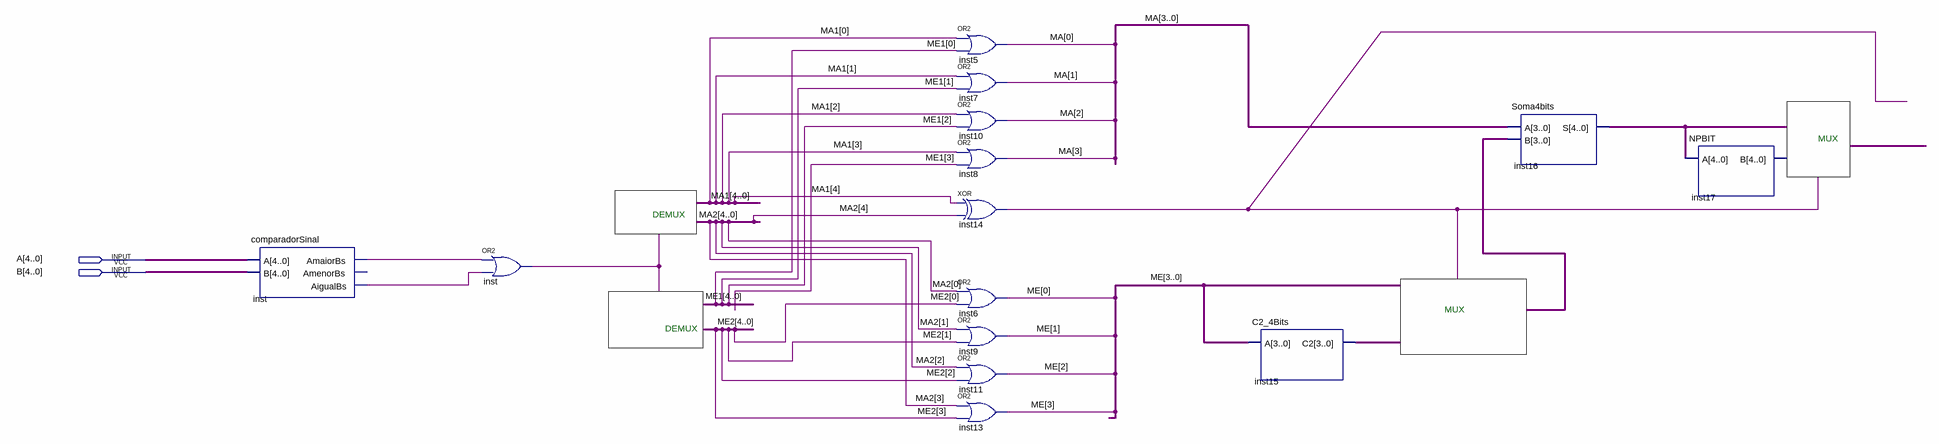
[diagram p0: schematic sheet]
// Quartus schematic Somador.bdf as structural Verilog: 14 symbols, 2 pins
module Somador (
  input  [4:0] A,
  input  [4:0] B
);

  wire inst14_out, inst_aigualbs, inst_amaiorbs, inst_out;
  wire [3:0] inst15_c2, MA, ME, ME1, ME2, undriven;
  wire [4:0] inst16_s, MA1, MA2;

  comparadorSinal inst (.A(A), .B(B), .AmaiorBs(inst_amaiorbs), .AigualBs(inst_aigualbs));  // open: AmenorBs
  or inst_dup2 (inst_out, inst_amaiorbs, inst_aigualbs);
  or inst5 (MA[0], MA1[0], ME1[0]);
  or inst7 (MA[1], MA1[1], ME1[1]);
  or inst10 (MA[2], MA1[2], ME1[2]);
  or inst8 (MA[3], MA1[3], ME1[3]);
  xor inst14 (inst14_out, MA1[4], MA2[4]);
  or inst6 (ME[0], MA2[0], ME2[0]);
  or inst9 (ME[1], MA2[1], ME2[1]);
  or inst11 (ME[2], MA2[2], ME2[2]);
  or inst13 (ME[3], MA2[3], ME2[3]);
  C2_4Bits inst15 (.A(ME), .C2(inst15_c2));
  Soma4bits inst16 (.A(MA), .B(undriven), .S(inst16_s));
  NPBIT inst17 (.A(inst16_s));  // open: B

  // Notes on the sheet:
  //   MUX
  //   DEMUX
  //   MUX
  //   DEMUX
endmodule
